# EAGLE design omnetics_to_electrode (EAGLE 7.2.0)
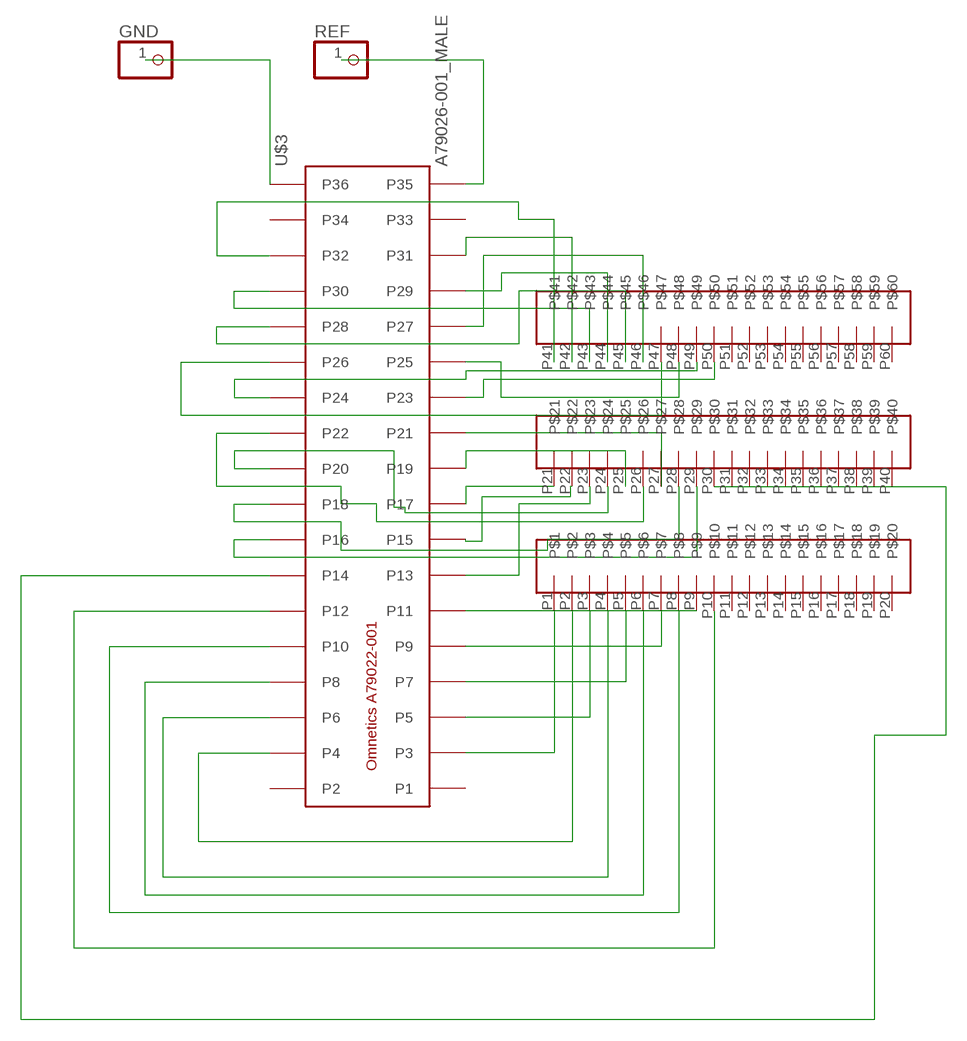
[diagram p0: schematic, sheet 1]

## Parts
GND  PINHD-1X1  [1X01]
REF  PINHD-1X1  [1X01]
U$1  ELEC_CONNECTOR  [ELEC_CONNECTOR]
U$3  A79026-001_MALE  [A79026-001_MALE]

## Nets
GND: GND.1 U$3.P36
N$1: U$1.P1 U$3.P3
N$2: U$1.P2 U$3.P4
N$3: U$1.P3 U$3.P5
N$4: U$1.P4 U$3.P6
N$5: U$1.P5 U$3.P7
N$6: U$1.P6 U$3.P8
N$7: U$1.P7 U$3.P9
N$8: U$1.P8 U$3.P10
N$9: U$1.P9 U$3.P11
N$10: U$1.P10 U$3.P12
N$15: U$1.P21 U$3.P17
N$16: U$1.P23 U$3.P13
N$17: U$1.P22 U$3.P15
N$18: U$1.P30 U$3.P14
N$19: U$1.P25 U$3.P19
N$20: U$1.P27 U$3.P21
N$21: U$1.P29 U$3.P16
N$22: U$1.P28 U$3.P18
N$23: U$1.P26 U$3.P22
N$24: U$1.P24 U$3.P20
N$25: U$1.P50 U$3.P23
N$26: U$1.P49 U$3.P24
N$27: U$1.P48 U$3.P25
N$28: U$1.P47 U$3.P26
N$29: U$1.P46 U$3.P27
N$30: U$1.P45 U$3.P28
N$31: U$1.P44 U$3.P29
N$32: U$1.P43 U$3.P30
N$33: U$1.P42 U$3.P31
N$34: U$1.P41 U$3.P32
REF: REF.1 U$3.P35
Unconnected: U$1.P11 U$1.P12 U$1.P13 U$1.P14 U$1.P15 U$1.P16 U$1.P17 U$1.P18 U$1.P19 U$1.P20 U$1.P31 U$1.P32 U$1.P33 U$1.P34 U$1.P35 U$1.P36 U$1.P37 U$1.P38 U$1.P39 U$1.P40 U$1.P51 U$1.P52 U$1.P53 U$1.P54 U$1.P55 U$1.P56 U$1.P57 U$1.P58 U$1.P59 U$1.P60 U$3.P1 U$3.P2 U$3.P33 U$3.P34

## Library data of the parts
GND REF = pinhead:PINHD-1X1: PIN HEADER
U$1 = mayo_parts:ELEC_CONNECTOR
U$3 = omnetics:A79026-001_MALE

## Board
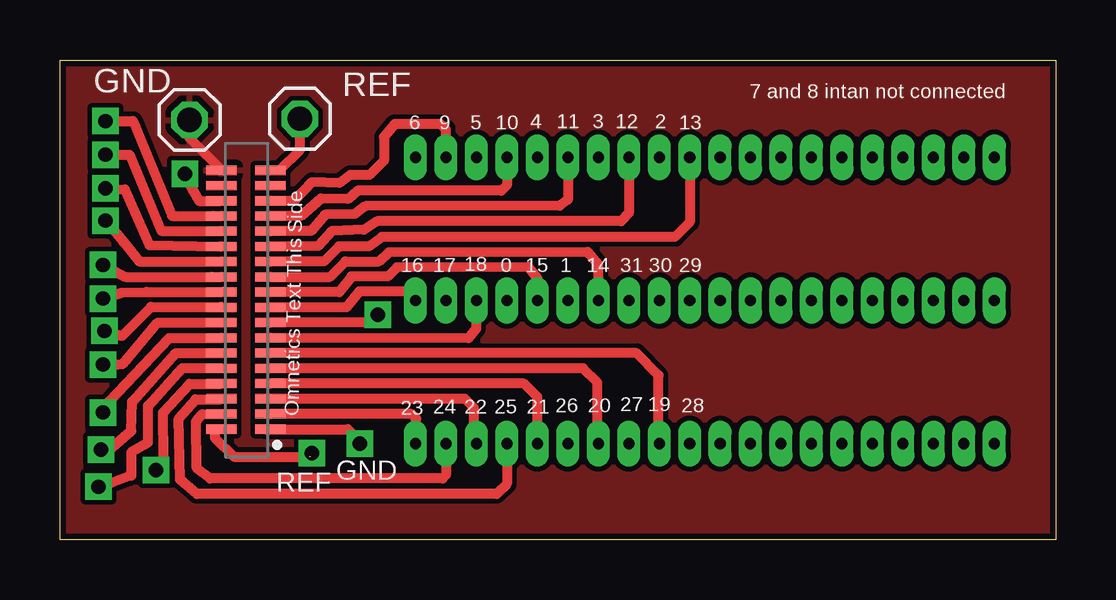
[diagram p1: board, top side]
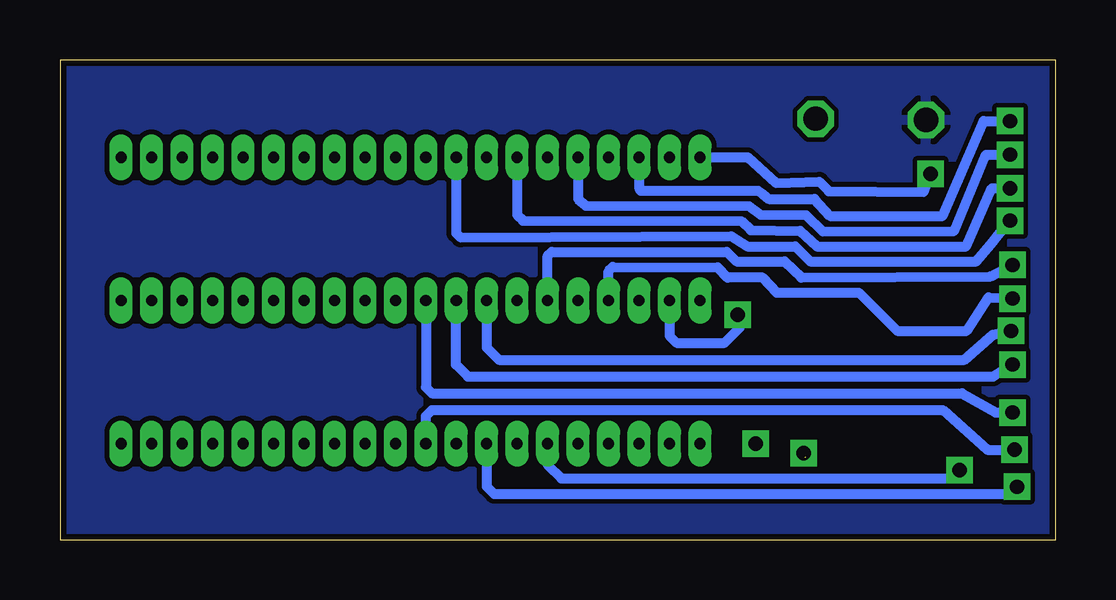
[diagram p2: board, bottom side, seen from below]

Size 41.5 x 20 mm. Coordinates in mm from the lower left corner, seen from the top.
Outline: 0,0 0,20 41.5,20 41.5,0 0,0
Copper layers (1*16): Top 0.035mm / dielectric 1.5mm / Bottom 0.035mm
Design rules "pcbtrain": minimum track width 0.2mm, minimum drill 0.4mm, track to track 0.2mm, track to pad 0.2mm, pad to pad 0.2mm, via to via 0.2mm, smd to smd 0mil, copper to edge 10mil, drill to drill 0.2mm, minimum pad ring 10mil, minimum via ring 10mil, stop-mask expansion 0.125mm, vias tented up to drill 0mil, thermal gap 10mil

### Footprints (pad centres in the part's own frame; a part is rotated, then mirrored left to right if it is on the bottom)
1X01 = drill 1.016 octagon: 1 0,0
ELEC_CONNECTOR = drill 0.46 pad 0.813 long: P1 -11.43,0; P2 -10.16,0; P3 -8.89,0; P4 -7.62,0; P5 -6.35,0; P6 -5.08,0; P7 -3.81,0; P8 -2.54,0; P9 -1.27,0; P10 0,0; P11 1.27,0; P12 2.54,0; P13 3.81,0; P14 5.08,0; P15 6.35,0; P16 7.62,0; P17 8.89,0; P18 10.16,0; P19 11.43,0; P20 12.7,0; P21 -11.43,5.969; P22 -10.16,5.969; P23 -8.89,5.969; P24 -7.62,5.969; P25 -6.35,5.969; P26 -5.08,5.969; P27 -3.81,5.969; P28 -2.54,5.969; P29 -1.27,5.969; P30 0,5.969; P31 1.27,5.969; P32 2.54,5.969; P33 3.81,5.969; P34 5.08,5.969; P35 6.35,5.969; P36 7.62,5.969; P37 8.89,5.969; P38 10.16,5.969; P39 11.43,5.969; P40 12.7,5.969; P41 -11.43,11.938; P42 -10.16,11.938; P43 -8.89,11.938; P44 -7.62,11.938; P45 -6.35,11.938; P46 -5.08,11.938; P47 -3.81,11.938; P48 -2.54,11.938; P49 -1.27,11.938; P50 0,11.938; P51 1.27,11.938; P52 2.54,11.938; P53 3.81,11.938; P54 5.08,11.938; P55 6.35,11.938; P56 7.62,11.938; P57 8.89,11.938; P58 10.16,11.938; P59 11.43,11.938; P60 12.7,11.938
A79026-001_MALE = smd 0.381 x 1.27: P1 -5.397,-1.016; P2 -5.397,1.016; P3 -4.763,-1.016; P4 -4.763,1.016; P5 -4.128,-1.016; P6 -4.128,1.016; P7 -3.493,-1.016; P8 -3.493,1.016; P9 -2.857,-1.016; P10 -2.857,1.016; P11 -2.223,-1.016; P12 -2.223,1.016; P13 -1.587,-1.016; P14 -1.587,1.016; P15 -0.953,-1.016; P16 -0.953,1.016; P17 -0.318,-1.016; P18 -0.318,1.016; P19 0.318,-1.016; P20 0.318,1.016; P21 0.953,-1.016; P22 0.953,1.016; P23 1.587,-1.016; P24 1.587,1.016; P25 2.223,-1.016; P26 2.223,1.016; P27 2.857,-1.016; P28 2.857,1.016; P29 3.493,-1.016; P30 3.493,1.016; P31 4.128,-1.016; P32 4.128,1.016; P33 4.763,-1.016; P34 4.763,1.016; P35 5.397,-1.016; P36 5.397,1.016

### Placement (x,y rotation side)
GND  5.4,17.5 0 top
REF  10,17.55 0 top
U$1  26.25,4 0 top
U$3  7.75,10 90 top

### Tracks (layer width: path | path; a pad name or v marks a point on that pad's centre or on a via)
GND
  Top 0.406: U$3.P36 5.85,16.3 5.4,16.75 GND.1
  pour Bottom: 0,20 41.5,20 41.5,0 0,0
  pour Top: 0,20 41.5,20 41.5,0 0,0
N$1
  Top 0.406: U$1.P1 14.85,4.03 14.85,5.05 14.66,5.24 U$3.P3
N$2
  Top 0.406: U$1.P2 16.09,2.69 15.95,2.55 6.25,2.55 5.7,2.98 5.67,4.92 5.9,5.2 5.95,5.22 U$3.P4 6.77,5.22
N$3
  Top 0.406: U$1.P3 17.25,4.11 17.25,5.5 16.88,5.87 U$3.P5
N$4
  Top 0.406: 18.65,3.98 U$1.P4 18.63,2.33 18.2,1.9 5.7,1.9 5,2.5 4.95,5.05 5.65,5.85 6.71,5.85 U$3.P6
N$5
  Top 0.406: U$1.P5 19.9,5.95 19.34,6.51 U$3.P7
N$6  (via drill 0.6)
  Top 0.406: v4,2.9 4.1,3.17 4.33,3.38 4.3,5.3 5.4,6.5 U$3.P8
  Bottom 0.406: U$1.P6 21.17,3.12 20.6,2.55 4.35,2.55 v4,2.9
N$7
  Top 0.406: U$1.P7 22.4,4.04 22.4,6.55 21.81,7.14 U$3.P9
N$8  (via drill 0.6)
  Top 0.406: U$3.P10 5.1,7.15 3.67,5.58 3.67,4.05 2.98,3.65 2.98,2.67 2.1,2.35 v1.6,2.2
  Bottom 0.406: U$1.P8 23.71,2.21 23.4,1.9 2.1,1.9 v1.6,2.2
N$9
  Top 0.406: U$1.P9 24.95,4.03 24.95,6.85 24.02,7.78 U$3.P11
N$10  (via drill 0.6)
  Top 0.406: v1.7,3.75 2.05,3.75 2.98,4.53 3,5.75 4.83,7.78 6.69,7.78 U$3.P12
  Bottom 0.406: U$1.P10 26.25,5.15 26,5.4 4.7,5.4 2.85,3.75 v1.7,3.75
N$15
  Top 0.406: U$1.P21 14.64,10.35 12.48,10.35 11.93,9.68 U$3.P17
N$16
  Top 0.406: U$1.P23 17.35,9.96 17.35,8.8 17.01,8.39 U$3.P13
N$17  (via drill 0.6)
  Top 0.406: U$3.P15 12.9,9.05 v13.25,9.38
  Bottom 0.406: v13.25,9.38 13.17,8.82 13.8,8.2 15.8,8.2 16.09,8.49 U$1.P22
N$18  (via drill 0.6)
  Top 0.406: U$3.P14 6.67,8.4 4.55,8.4 2.02,5.75 1.85,5.35 v1.8,5.3
  Bottom 0.406: U$1.P30 26.25,6.35 26,6.1 3.9,6.1 2.5,5.3 v1.8,5.3
N$19
  Top 0.406: U$1.P25 19.9,10.9 19.52,11.38 14.05,11.35 13.67,10.97 12.15,10.97 11.64,10.32 U$3.P19
N$20
  Top 0.406: U$1.P27 22.44,11.46 22,12 13.7,11.97 13.3,11.6 11.9,11.6 11.25,10.95 U$3.P21
N$21  (via drill 0.6)
  Top 0.406: U$3.P16 4.08,9.05 2.62,7.33 2.4,7.3 v1.8,7.3
  Bottom 0.406: v1.8,7.3 2.6,6.8 24.5,6.8 25,7.3 25,9.95 U$1.P29
N$22  (via drill 0.6)
  Top 0.406: v1.85,8.7 2.6,8.5 3.8,9.7 6.72,9.7 U$3.P18
  Bottom 0.406: U$1.P28 23.71,8.01 23.2,7.5 3.8,7.5 2.6,8.55 v1.85,8.7
N$23  (via drill 0.6)
  Top 0.406: v1.8,11.45 2.73,10.95 6.33,10.95 U$3.P22
  Bottom 0.406: U$1.P26 21.17,11.83 21,12 13.7,12 13.3,11.6 11.3,11.6 10.6,10.93 2.7,10.97 v1.8,11.45
N$24  (via drill 0.6)
  Top 0.406: v1.8,10.05 2.58,10.3 3.6,10.32 6.79,10.32 U$3.P20
  Bottom 0.406: U$1.P24 18.63,11.2 18.45,11.38 14.08,11.35 13.67,10.93 12.2,10.93 11.62,10.3 8.2,10.3 6.6,8.7 3.7,8.7 2.8,10.1 v1.8,10.05
N$25
  Top 0.406: U$1.P50 26.25,13.25 25.62,12.62 13.42,12.62 12.88,12.22 11.62,12.22 11,11.6 U$3.P23
N$26  (via drill 0.6)
  Top 0.406: v1.9,13.3 2.65,12.4 3.3,11.6 U$3.P24
  Bottom 0.406: U$1.P49 24.98,12.78 24.8,12.6 13.52,12.65 12.85,12.22 10.85,12.22 10.23,11.6 3.3,11.6 2.7,12.3 v1.9,13.3
N$27
  Top 0.406: U$1.P48 23.71,13.61 23.4,13.28 13.23,13.28 12.67,12.93 11.35,12.88 10.77,12.25 8.96,12.22 U$3.P25
N$28  (via drill 0.6)
  Top 0.406: v1.9,14.65 2.7,14.6 3.73,12.28 6.69,12.22 U$3.P26
  Bottom 0.406: U$1.P47 22.44,13.54 22.2,13.3 13.1,13.28 12.7,12.9 10.65,12.88 9.95,12.22 3.73,12.22 2.65,14.65 v1.9,14.65
N$29
  Top 0.406: U$1.P46 21.17,14.17 20.83,13.93 12.73,13.9 12.3,13.57 11.05,13.55 10.48,12.88 8.78,12.88 U$3.P27
N$30  (via drill 0.6)
  Top 0.406: v1.9,16.05 2.9,16.05 4.23,12.88 6.72,12.88 U$3.P28
  Bottom 0.406: U$1.P45 19.9,14.2 19.58,13.93 12.77,13.9 12.3,13.55 10.4,13.53 9.7,12.85 4.23,12.88 2.9,16.05 v1.9,16.05
N$31
  Top 0.406: U$1.P44 18.63,14.78 18.4,14.55 12.4,14.55 12,14.2 10.88,14.22 10.05,13.5 U$3.P29
N$32  (via drill 0.6)
  Top 0.406: v1.9,17.45 3.05,17.45 4.67,13.5 6.38,13.5 U$3.P30
  Bottom 0.406: v1.9,17.45 3,17.45 4.7,13.5 9.4,13.5 10.05,14.2 11.95,14.2 12.2,14.4 12.4,14.55 17.3,14.55 17.36,14.66 U$1.P43
N$33
  Top 0.406: U$1.P42 16.09,17.11 15.85,17.32 13.95,17.32 13.5,16.8 13.5,15.8 12.9,15.2 12.1,15.2 11.65,14.88 10.5,14.9 9.75,14.12 8.84,14.12 U$3.P31
N$34  (via drill 0.6)
  Top 0.406: v5.2,15.25 5.55,14.55 5.8,14.12 6.71,14.12 U$3.P32
  Bottom 0.406: U$1.P41 12.84,15.94 11.65,14.88 9.85,14.93 9.45,14.53 5.5,14.5 v5.2,15.25
N$36  (via drill 0.6)  (1 unrouted)
  Top 0.406: 6.45,4.6 6.45,4.25 7.25,3.45 10.4,3.45 10.45,3.5 | 10.45,3.45 v10.5,3.6
N$37  (via drill 0.6)
  Top 0.406: 8.55,4.6 12,4.6 12.5,4.1 v12.5,4
REF
  Top 0.406: U$3.P35 9.15,15.4 10,16.25 REF.1

### Text on the board
tNames: 7 and 8 intan not connected | 6 | 9 | 5 | 10 | 4 | 11 | 3 | 12 | 2 | 13 | 16 | 17 | 18 | 0 | 15 | 1 | 14 | 31 | 30 | 29 | Omnetics Text This Side | 23 | 24 | 22 | 25 | 21 | 26 | 20 | 27 | 19 | 28 | GND | REF